# EAGLE design pure_energy (EAGLE 9.5.2)
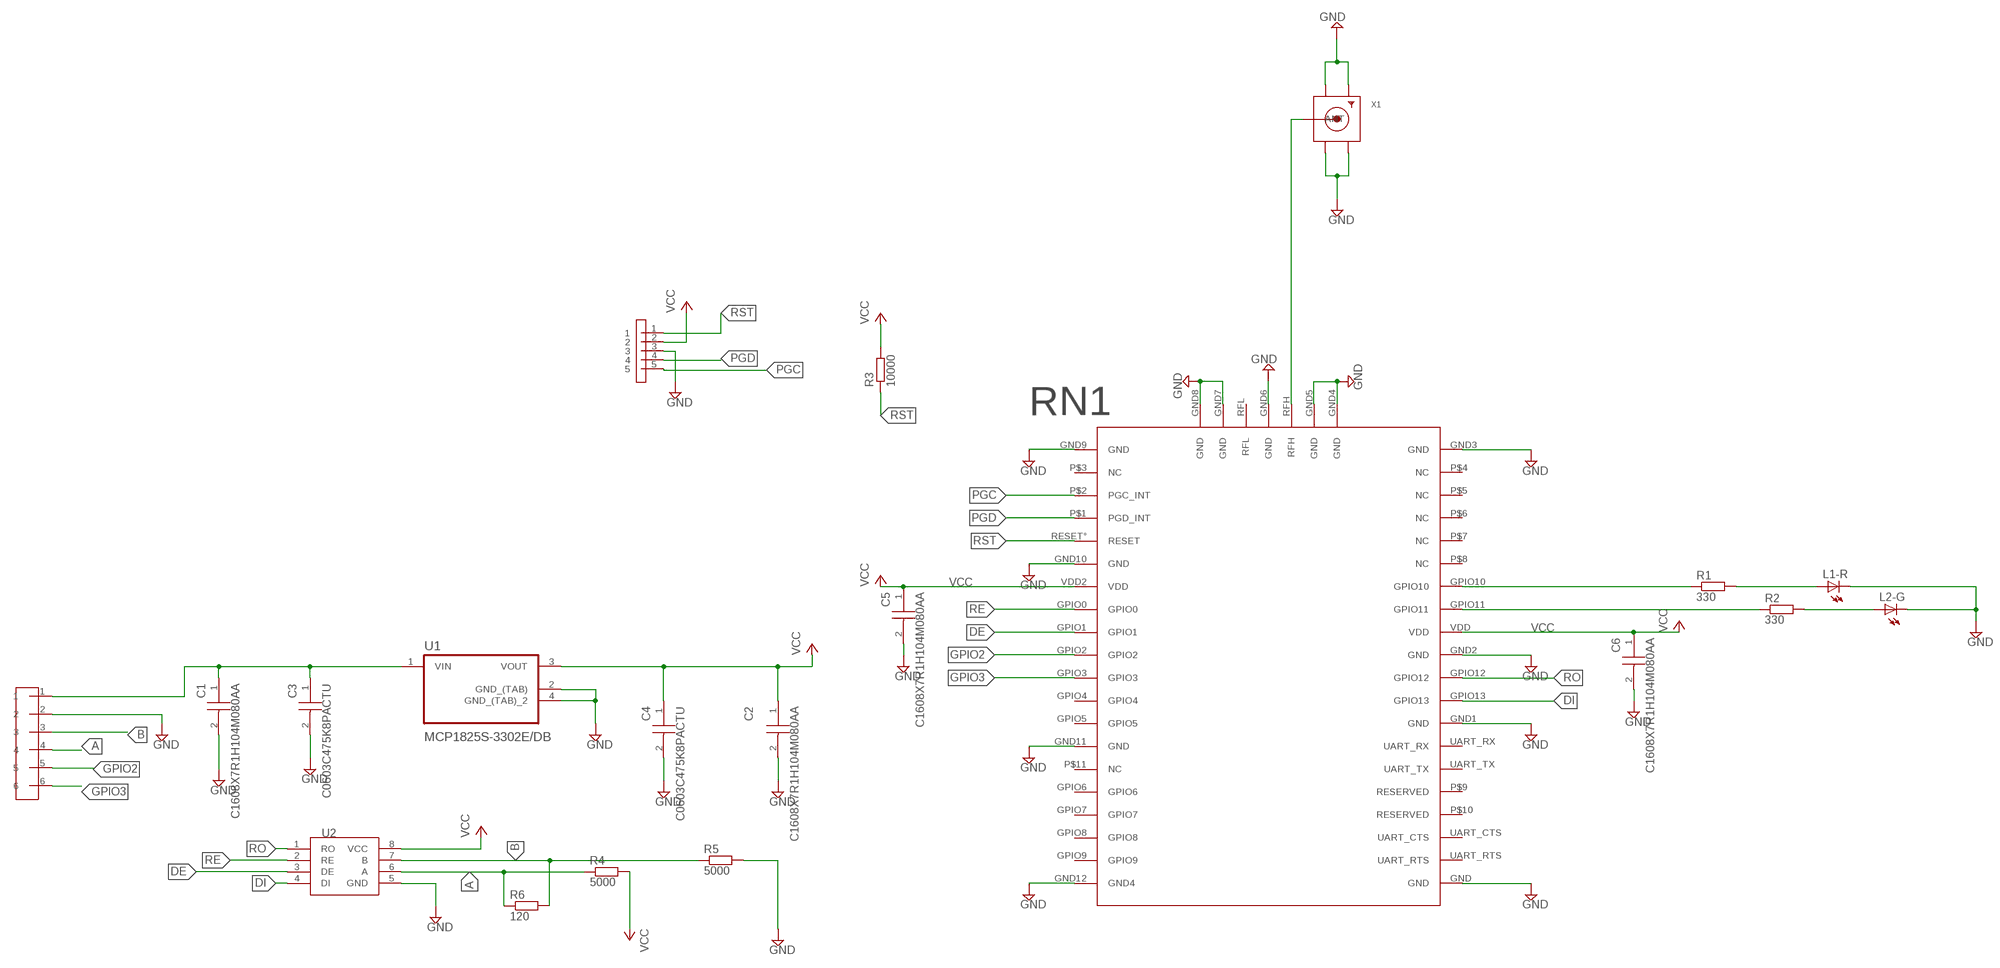
[diagram p0: schematic, sheet 1]

## Parts
C1  C1608X7R1H104M080AA  [CAPC1608X80N]
C2  C1608X7R1H104M080AA  [CAPC1608X80N]
C3  C0603C475K8PACTU  [CAPC1608X85N]
C4  C0603C475K8PACTU  [CAPC1608X85N]
C5  C1608X7R1H104M080AA  [CAPC1608X80N]
C6  C1608X7R1H104M080AA  [CAPC1608X80N]
L1-R  LEDCHIP-LED0603  [CHIP-LED0603]
L2-G  LEDCHIP-LED0603  [CHIP-LED0603]
R1  330  R-EU_R0603  [R0603]
R2  330  R-EU_R0603  [R0603]
R3  10000  R-EU_R0603  [R0603]
R4  5000  R-EU_R0805  [R0805]
R5  5000  R-EU_R0805  [R0805]
R6  120  R-EU_R0805  [R0805]
RN1  NEW_RN2483  [NEW_RN2483]
U1  MCP1825S-3302E/DB  [SOT230P700X180-4N]
U2  AMD3485E  [AMD3485E]
U$1  CONNECTOR6_V2  [CONNECTOR6_V2]
U$3  ICSP_V2  [ICSP_V2]
X1  SMACONNECTOR_EDGE  [SMA_EDGELAUNCH]

## Nets
A: R4.1 R6.1 U2.6(A) U$1.4
B: R5.1 R6.2 U2.7(B) U$1.3
DE: RN1.GPIO1 U2.3(DE)
DI: RN1.GPIO13 U2.4(DI)
GND: C1.2 C2.2 C3.2(C2) C4.2(C2) C5.2 C6.2 L1-R.C L2-G.C R5.2 RN1.GND RN1.GND1(GND) RN1.GND2(GND) RN1.GND3(GND) RN1.GND4(GND) RN1.GND5(GND) RN1.GND6(GND) RN1.GND7(GND) RN1.GND8(GND) RN1.GND9(GND) RN1.GND10(GND) RN1.GND11(GND) RN1.GND12(GND4) U1.2(GND_(TAB)) U1.4(GND_(TAB)_2) U2.5(GND) U$1.2 U$3.3 X1.GND@1(GND4) X1.GND@2(GND3) X1.GND@3(GND2) X1.GND@4(GND1)
GPIO2: RN1.GPIO2 U$1.5
GPIO3: RN1.GPIO3 U$1.6
N$1: C1.1 C3.1(C1) U1.1(VIN) U$1.1
N$10: R1.1 RN1.GPIO10
N$11: R2.1 RN1.GPIO11
N$12: L1-R.A R1.2
N$13: L2-G.A R2.2
N$15: RN1.RFH X1.P(ANT)
PGC: RN1.P$2(PGC_INT) U$3.5
PGD: RN1.P$1(PGD_INT) U$3.4
RE: RN1.GPIO0 U2.2(RE)
RO: RN1.GPIO12 U2.1(RO)
RST: R3.1 RN1.RESET°(RESET) U$3.1
VCC: C2.1 C4.1(C1) C5.1 C6.1 R3.2 R4.2 RN1.VDD RN1.VDD2(VDD) U1.3(VOUT) U2.8(VCC) U$3.2
Unconnected: RN1.GPIO4 RN1.GPIO5 RN1.GPIO6 RN1.GPIO7 RN1.GPIO8 RN1.GPIO9 RN1.P$3(NC) RN1.P$4(NC) RN1.P$5(NC) RN1.P$6(NC) RN1.P$7(NC) RN1.P$8(NC) RN1.P$9(RESERVED) RN1.P$10(RESERVED) RN1.P$11(NC) RN1.RFL RN1.UART_CTS RN1.UART_RTS RN1.UART_RX RN1.UART_TX

## Library data of the parts
C1 C2 C5 C6 = C1608X7R1H104M080AA:C1608X7R1H104M080AA: TDK 0603 C 100nF Ceramic Multilayer Capacitor, 50 V dc, +125C, X7R Dielectric, +/-20% Source: Datasheet <https://product.tdk.com/info/en/catalog/datasheets/mlcc_commercial_midvoltage_en.pdf>; ARROW_PART_NUMBER: C1608X7R1H104M080AA; ARROW_PRICE-STOCK: https://www.arrow.com/en/products/c1608x7r1h104m080aa/tdk; DESCRIPTION: TDK 0603 C 100nF Ceramic Multilayer Capacitor, 50 V dc, +125C, X7R Dielectric, +/-20%; HEIGHT: 0.8mm; MANUFACTURER_NAME: TDK; MANUFACTURER_PART_NUMBER: C1608X7R1H104M080AA; MOUSER_PART_NUMBER: 810-C1608X7R1H104M; MOUSER_PRICE-STOCK: https://www.mouser.co.uk/ProductDetail/TDK/C1608X7R1H104M080AA?qs=dfay7wIA1uEL2BE%2FFUaTdg%3D%3D
C3 C4 = C0603C475K8PACTU:C0603C475K8PACTU: CAPACITOR, 0603 4.7uF +/-10% 10V Source: Datasheet <http://componentsearchengine.com/Datasheets/1/C0603C475K8PACTU.pdf>; ARROW_PART_NUMBER: C0603C475K8PACTU; ARROW_PRICE-STOCK: https://www.arrow.com/en/products/c0603c475k8pactu/kemet-corporation; DESCRIPTION: CAPACITOR, 0603 4.7uF +/-10% 10V; HEIGHT: mm; MANUFACTURER_NAME: Kemet; MANUFACTURER_PART_NUMBER: C0603C475K8PACTU; MOUSER_PART_NUMBER: 80-C0603C475K8P; MOUSER_PRICE-STOCK: https://www.mouser.co.uk/ProductDetail/KEMET/C0603C475K8PACTU?qs=K%2Fj%2Fqf%252B0fqK6lAUxhlPmKA%3D%3D
L1-R L2-G = adafruit:LED: LED OSRAM: - CHIPLED LG R971, LG N971, LY N971, LG Q971, LY Q971, LO R971, LY R971 LH N974, LH R974 LS Q976, LO Q976, LY Q976 LO Q996 - Hyper CHIPLED LW Q18S LB Q993, LB Q99A, LB R99A - SideLED LS A670, LO A670, LY A670, LG A670, LP A670 LB A673, LV A673, LT A673, LW A673 LH A674 LY A675 LS A676, LA A676, LO A676, LY A676, LW A676 LS A679, LY A679, LG A679 - Hyper Micro SIDELED® LS Y876, LA Y876, LO Y876, LY Y876 LT Y87S - SmartLED LW L88C, LW L88S LB L89C, LB L89S, LG L890 LS L89K, LO L89K, LY L89K LS L896, LA L896, LO L896, LY L896 - TOPLED LS T670, LO T670, LY T670, LG T670, LP T670 LSG T670, LSP T670, LSY T670, LOP T670, LYG T670 LG T671, LOG T671, LSG T671 LB T673, LV T673, LT T673, LW T673 LH T674 LS T676, LA T676, LO T676, LY T676, LB T676, LH T676, LSB T676, LW T676 LB T67C, LV T67C, LT T67C, LS T67K, LO T67K, LY T67K, LW E67C LS E67B, LA E67B, LO E67B, LY E67B, LB E67C, LV E67C, LT E67C LW T67C LS T679, LY T679, LG T679 LS T770, LO T770, LY T770, LG T770, LP T770 LB T773, LV T773, LT T773, LW T773 LH T774 LS E675, LA E675, LY E675, LS T675 LS T776, LA T776, LO T776, LY T776, LB T776 LHGB T686 LT T68C, LB T68C - Hyper Mini TOPLED® LB M676 - Mini TOPLED Santana® LG M470 LS M47K, LO M47K, LY M47K Source: http://www.osram.convergy.de/
R1-R6 = rcl:R-EU_: RESISTOR, European symbol; SPICEPREFIX: R
RN1 = tobias:NEW_RN2483
U1 = MCP1825S-3302E_DB:MCP1825S-3302E/DB; AVAILABILITY: Unavailable; DESCRIPTION: Linear Voltage Regulator IC 1 Output 500mA SOT-223-3; MF: Microchip; MP: MCP1825S-3302E/DB; PACKAGE: SOT-223 Microchip; PRICE: None
U2 = AMD3485E:AMD3485E
U$1 = conn4:CONNECTOR6_V2
U$3 = conn4:ICSP_V2
X1 = adafruit:SMACONNECTOR: SMA Connector 90° DIP SMA Connector, 50 Ohm (4UConnector: 07259)

## Net classes
0 default: width 0.305 mm, drill 0.508 mm, clearance 0.254 mm

## Board
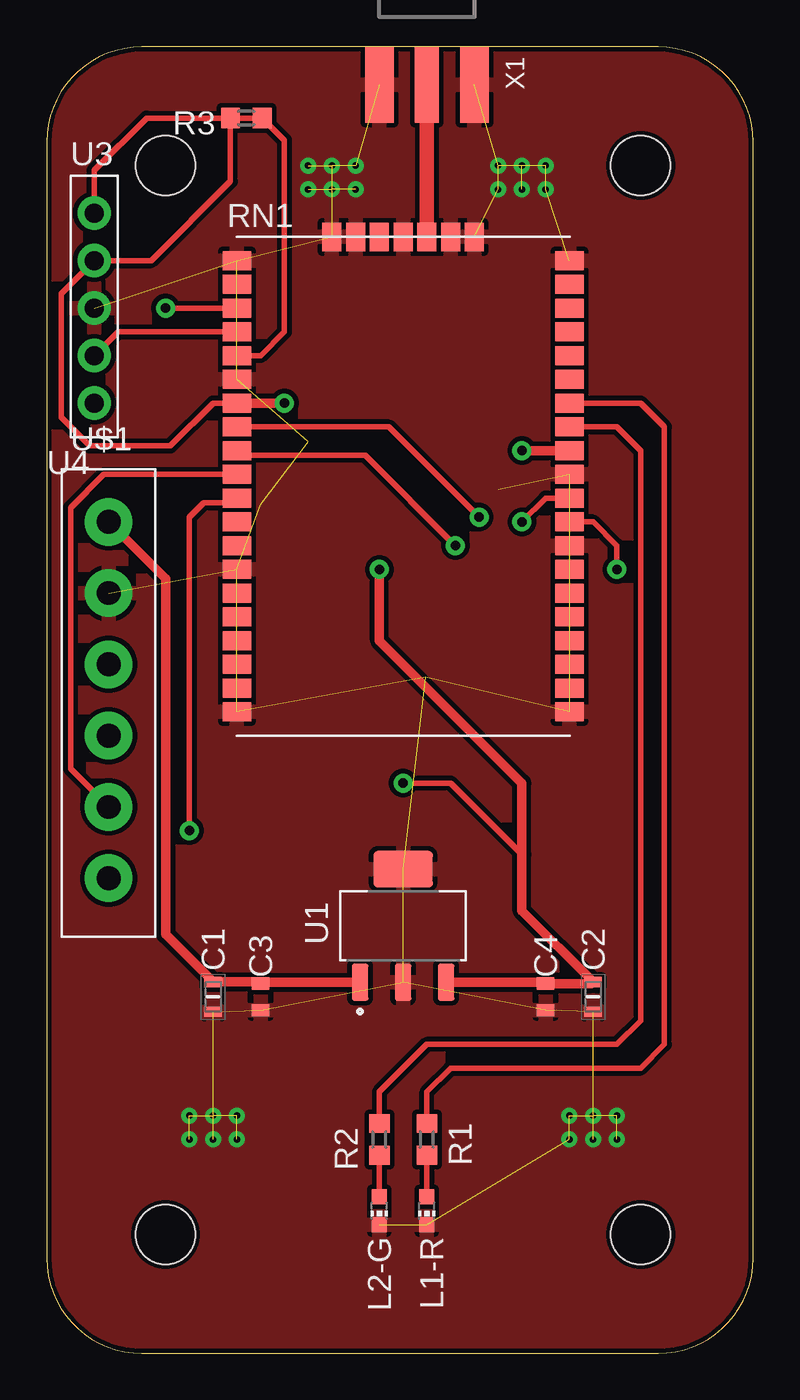
[diagram p1: board, top side]
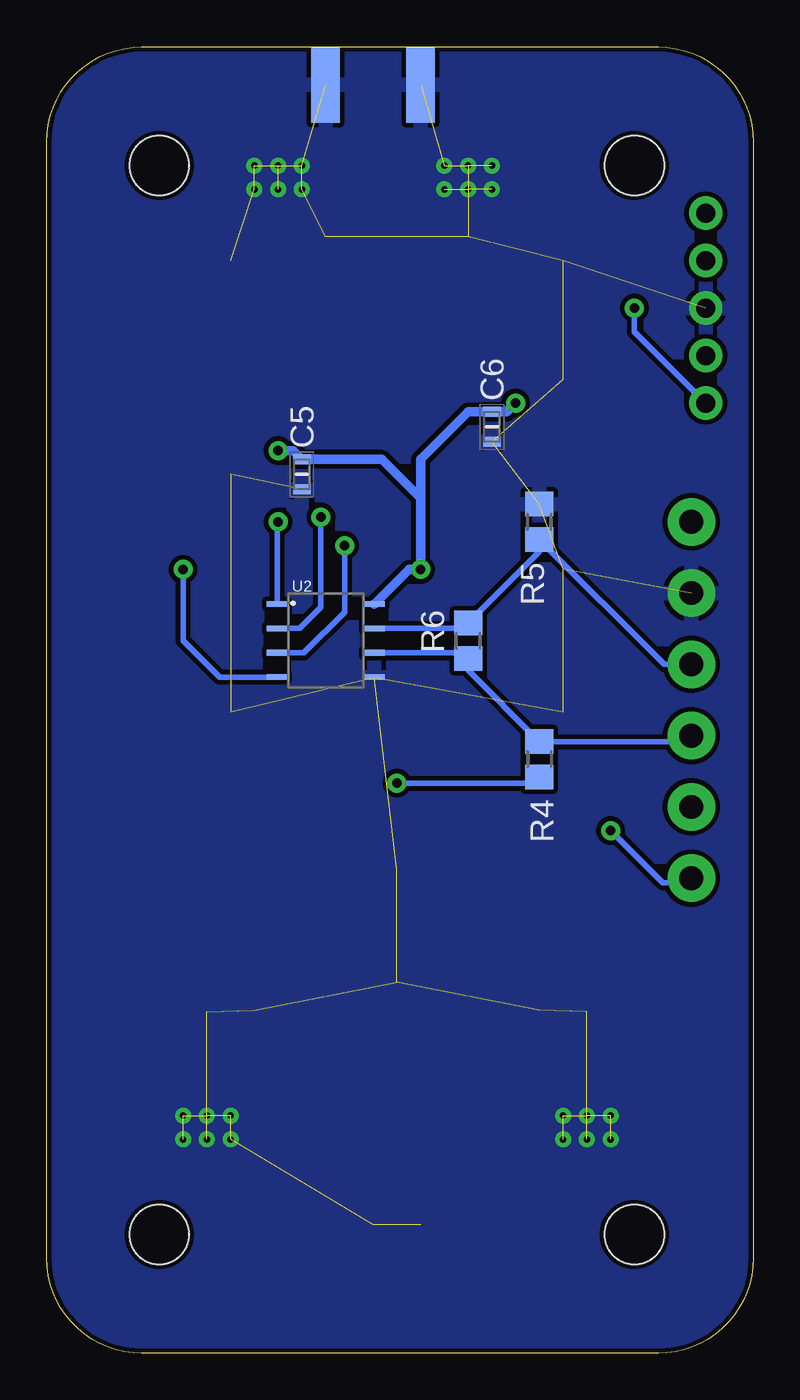
[diagram p2: board, bottom side, seen from below]

Size 37.77 x 69.84 mm. Coordinates in mm from the lower left corner, seen from the top.
Outline: 0,64.76 0,5.08 arc90 5.08,0 32.69,0 arc90 37.77,5.08 37.77,64.76 arc90 32.69,69.84 5.08,69.84 arc90 0,64.76
Copper layers (1*16): Top 0.035mm / dielectric 1.5mm / Bottom 0.035mm
Design rules "SparkFun": minimum track width 8mil, minimum drill 20mil, track to track 8mil, track to pad 8mil, pad to pad 8mil, via to via 8mil, smd to smd 8mil, copper to edge 10mil, drill to drill 8mil, minimum pad ring 12mil, minimum via ring 10mil, stop-mask expansion 4mil, vias tented up to drill 25mil, thermal gap 10mil
Holes 3.17 mm at 31.75,63.5 31.75,6.35 6.35,6.35 6.35,63.5

### Footprints (pad centres in the part's own frame; a part is rotated, then mirrored left to right if it is on the bottom)
CAPC1608X80N = smd 0.54 x 0.94: 1 -0.8,0; 2 0.8,0
CAPC1608X85N = smd 0.66 x 0.94: 1 -0.711,0; 2 0.711,0
CHIP-LED0603 = smd 0.8 x 0.8: A 0,-0.75; C 0,0.75
R0603 = smd 1 x 1.1: 1 -0.85,0; 2 0.85,0
R0805 = smd 1.3 x 1.5: 1 -0.95,0; 2 0.95,0
NEW_RN2483 = smd 1.524 x 1.016: GND 17.78,1.27; GND1 17.78,10.16; GND2 17.78,13.97; GND3 17.78,25.4; GND9 0,25.4; GND10 0,19.05; GND11 0,8.89; GND12 0,1.27; GPIO0 0,16.51; GPIO1 0,15.24; GPIO2 0,13.97; GPIO3 0,12.7; GPIO4 0,11.43; GPIO5 0,10.16; GPIO6 0,6.35; GPIO7 0,5.08; GPIO8 0,3.81; GPIO9 0,2.54; GPIO10 17.78,17.78; GPIO11 17.78,16.51; GPIO12 17.78,12.7; GPIO13 17.78,11.43; P$1 0,21.59; P$2 0,22.86; P$3 0,24.13; P$4 17.78,24.13; P$5 17.78,22.86; P$6 17.78,21.59; P$7 17.78,20.32; P$8 17.78,19.05; P$9 17.78,6.35; P$10 17.78,5.08; P$11 0,7.62; RESET° 0,20.32; UART_CTS 17.78,3.81; UART_RTS 17.78,2.54; UART_RX 17.78,8.89; UART_TX 17.78,7.62; VDD 17.78,15.24; VDD2 0,17.78 | smd 1.016 x 1.524: GND4 12.7,26.67; GND5 11.43,26.67; GND6 8.89,26.67; GND7 6.35,26.67; GND8 5.08,26.67; RFH 10.16,26.67; RFL 7.62,26.67
SOT230P700X180-4N = smd 1.97 x 0.89: 1 -3.025,2.3; 2 -3.025,0; 3 -3.025,-2.3 | smd 1.97 x 3.19: 4 3.025,0
AMD3485E = smd 1.1 x 0.3: 1 -2.6,1.95; 2 -2.6,0.65; 3 -2.6,-0.65; 4 -2.6,-1.95; 5 2.6,-1.95; 6 2.6,-0.65; 7 2.6,0.65; 8 2.6,1.95
CONNECTOR6_V2 = drill 1.27 pad 2.54: 1 -0.5,-3.81; 2 -0.5,-7.62; 3 -0.5,-11.43; 4 -0.5,-15.24; 5 -0.5,-19.05; 6 -0.5,-22.86
ICSP_V2 = drill 1.016 pad 1.778: 1 -0.002,-0.002; 2 -0.002,-2.542; 3 -0.002,-5.082; 4 -0.002,-7.622; 5 -0.002,-10.162
SMA_EDGELAUNCH = smd 4.064 x 1.524: GND@1 2.032,-2.54; GND@2 2.032,2.54 | smd 4.064 x 1.524 bottom: GND@3 2.032,2.54; GND@4 2.032,-2.54 | smd 4.064 x 1.27: P 2.032,0

### Placement (x,y rotation side)
C1  8.89,19.05 270 top
C2  29.21,19.05 270 top
C3  11.43,19.05 270 top
C4  26.67,19.05 270 top
C5  24.13,46.99 270 bottom
C6  13.97,49.53 270 bottom
L1-R  20.32,7.62 180 top
L2-G  17.78,7.62 180 top
R1  20.32,11.43 270 top
R2  17.78,11.43 270 top
R3  10.67,66.04 180 top
R4  11.43,31.75 270 bottom
R5  11.43,44.45 90 bottom
R6  15.24,38.1 90 bottom
RN1  10.16,33.02 0 top
U1  19.05,22.86 90 top
U2  22.86,38.1 0 bottom
U$1  3.81,48.26 0 top
U$3  2.54,60.96 0 top
X1  20.32,69.85 270 top

### Tracks (layer width: path | path; a pad name or v marks a point on that pad's centre or on a via)
A
  Bottom 0.305: U2.6 15.54,37.45 R6.1 15.24,36.51 R4.1 3.63,32.7 U$1.4
B
  Bottom 0.305: U2.7 15.54,38.75 R6.2 11.43,42.86 R5.1 4.76,36.83 U$1.3
DE  (via drill 0.51)
  Top 0.305: v21.84,43.18 17.02,48.01 10.41,48.01 RN1.GPIO1
  Bottom 0.305: U2.3 24.02,37.45 21.84,39.62 v21.84,43.18
DI  (via drill 0.51)
  Top 0.305: v30.48,41.91 30.48,43.18 29.21,44.45 RN1.GPIO13
  Bottom 0.305: U2.4 28.53,36.15 30.48,38.1 v30.48,41.91
GND  (via drill 0.35)  (54 unrouted)
  other vias: 25.4,63.5 26.67,63.5 26.67,62.23 25.4,62.23 15.24,63.5 15.24,62.23 13.97,62.23 13.97,63.5 7.62,11.43 8.89,11.43 10.16,11.43 10.16,12.7 8.89,12.7 7.62,12.7 27.94,12.7 29.21,12.7 30.48,12.7 30.48,11.43 29.21,11.43 27.94,11.43 24.13,63.5 24.13,62.23 16.51,63.5 16.51,62.23
  pour Top: -1.27,71.12 39.37,71.12 39.37,-1.27 -1.27,-1.27
  pour Bottom: -2.54,72.39 40.64,72.39 40.64,-2.54 -2.54,-2.54
GPIO2
  Top 0.305: U$1.5 1.27,31.25 1.27,45.21 3.05,46.99 RN1.GPIO2
GPIO3  (via drill 0.51)
  Top 0.305: RN1.GPIO3 9.91,45.47 8.38,45.47 7.62,44.7 v7.62,27.94
  Bottom 0.305: v7.62,27.94 4.83,25.15 3.56,25.15 U$1.6
N$1
  Top 0.508: U$1.1 6.35,41.41 6.35,22.39 C1.1 11.34,19.85 C3.1 11.5,19.84 U1.1
N$10
  Top 0.305: R1.1 20.32,13.97 21.59,15.24 31.75,15.24 33.02,16.51 33.02,49.53 31.75,50.8 RN1.GPIO10
N$11
  Top 0.305: RN1.GPIO11 30.48,49.53 31.75,48.26 31.75,17.78 30.48,16.51 20.32,16.51 17.78,13.97 R2.1
N$12
  Top 0.305: R1.2 L1-R.A
N$13
  Top 0.305: R2.2 L2-G.A
N$15
  Top 0.762: X1.P RN1.RFH
PGC  (via drill 0.51)
  Top 0.305: v6.35,55.88 RN1.P$2
  Bottom 0.305: v6.35,55.88 6.35,54.61 U$3.5
PGD
  Top 0.305: U$3.4 3.81,54.61 RN1.P$1
RE  (via drill 0.51)
  Top 0.305: v23.11,44.7 18.29,49.53 RN1.GPIO0
  Bottom 0.305: U2.2 24.24,38.75 23.11,39.88 v23.11,44.7
RO  (via drill 0.51)
  Top 0.305: v25.4,44.45 26.67,45.72 RN1.GPIO12
  Bottom 0.305: U2.1 25.46,44.39 v25.4,44.45
RST
  Top 0.305: RN1.RESET° 11.43,53.34 12.7,54.61 12.7,64.86 R3.1 5.33,66.04 2.54,63.24 U$3.1
VCC  (via drill 0.51)
  Top 0.305: R3.2 9.82,62.65 5.59,58.42 U$3.2 0.76,56.64 0.76,50.04 2.29,48.51 6.6,48.51 8.89,50.8 RN1.VDD2 | 25.4,26.67 21.59,30.48 v19.05,30.48
  Top 0.508: U1.3 26.6,19.84 C4.1 29.12,19.76 C2.1 25.4,23.66 25.4,26.67 25.4,30.48 17.78,38.1 v17.78,41.91 | v25.4,48.26 RN1.VDD | v12.7,50.8 RN1.VDD2
  Bottom 0.305: v19.05,30.48 11.75,30.48 R4.2
  Bottom 0.508: 17.78,45.72 v17.78,41.91 18.4,41.91 U2.8 | 17.78,45.72 17.78,47.79 15.24,50.33 C6.1 13.17,50.33 v12.7,50.8 | 17.78,45.72 19.85,47.79 C5.1 24.6,48.26 v25.4,48.26

### Text on the board
tNames: U3 | U4